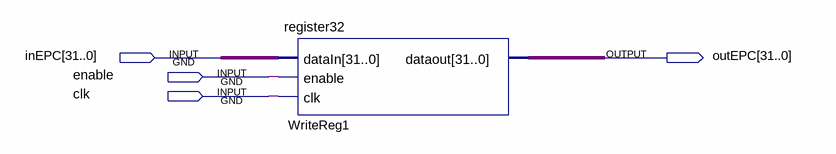
[diagram p0: schematic sheet]
// Quartus schematic EPC.bdf as structural Verilog: 1 symbols, 4 pins
module EPC (
  input  [31:0] inEPC,
  input  enable,
  input  clk,
  output [31:0] outEPC
);

  register32 WriteReg1 (.dataIn(inEPC), .enable(enable), .clk(clk), .dataout(outEPC));

  // Other names for the same wires on the sheet: vcc = enable
endmodule
